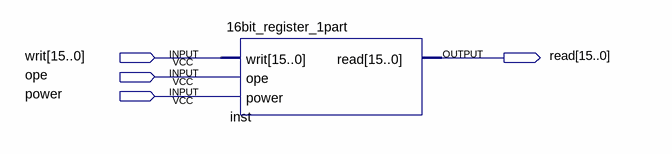
[diagram p0: schematic sheet]
// Quartus schematic testReg.bdf as structural Verilog: 1 symbols, 4 pins
module testReg (
  input  [15:0] writ,
  input  ope,
  input  power,
  output [15:0] read
);

  \16bit_register_1part  inst (.writ(writ), .ope(ope), .power(power), .read(read));
endmodule
